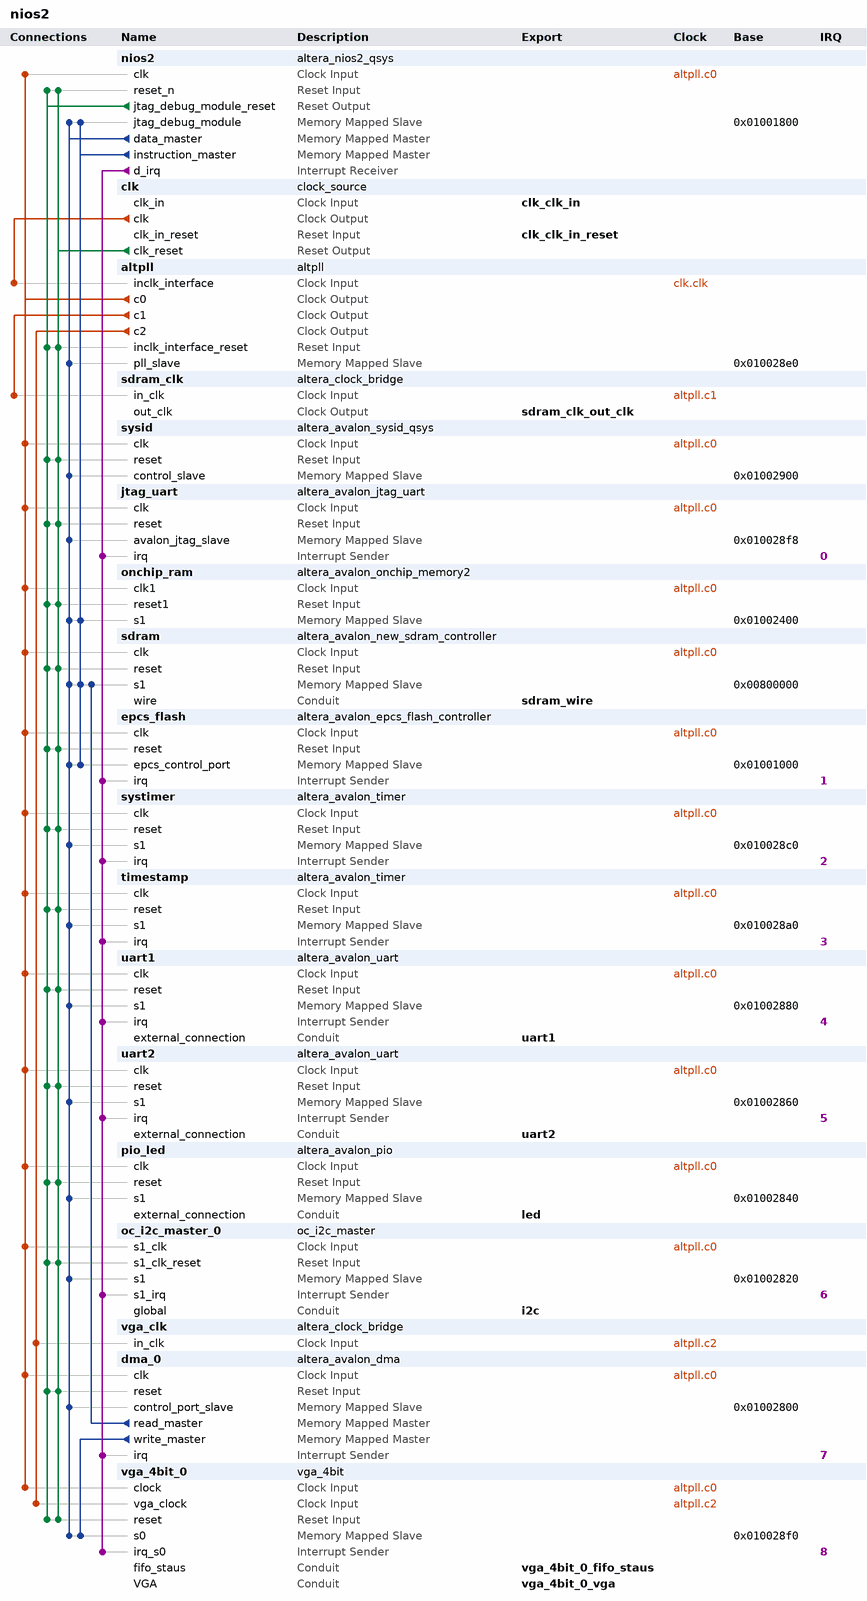
[diagram p0: system contents]
# Platform Designer (Qsys) system nios2, Cyclone II EP2C8T144C8
# Parameters at their usual value, and those the tool derives, are not listed.
package require -exact qsys 13.0.1
create_system nios2
set_project_property DEVICE_FAMILY {Cyclone II}
set_project_property DEVICE EP2C8T144C8

add_instance nios2 altera_nios2_qsys 13.0
set_instance_parameter_value nios2 muldiv_divider true
set_instance_parameter_value nios2 manuallyAssignCpuID false
set_instance_parameter_value nios2 resetSlave sdram.s1
set_instance_parameter_value nios2 mmu_TLBMissExcSlave None
set_instance_parameter_value nios2 exceptionSlave sdram.s1
set_instance_parameter_value nios2 breakSlave nios2.jtag_debug_module
set_instance_parameter_value nios2 impl Tiny
set_instance_parameter_value nios2 icache_size 4096

add_instance clk clock_source 13.0
set_instance_parameter_value clk clockFrequency 32000000

add_instance altpll altpll 13.0
set_instance_parameter_value altpll INCLK0_INPUT_FREQUENCY 31250
set_instance_parameter_value altpll GATE_LOCK_SIGNAL NO
set_instance_parameter_value altpll VALID_LOCK_MULTIPLIER 1
set_instance_parameter_value altpll INVALID_LOCK_MULTIPLIER 5
set_instance_parameter_value altpll CLK0_MULTIPLY_BY 3
set_instance_parameter_value altpll CLK1_MULTIPLY_BY 3
set_instance_parameter_value altpll CLK2_MULTIPLY_BY 5
set_instance_parameter_value altpll CLK0_DIVIDE_BY 1
set_instance_parameter_value altpll CLK1_DIVIDE_BY 1
set_instance_parameter_value altpll CLK2_DIVIDE_BY 4
set_instance_parameter_value altpll CLK1_PHASE_SHIFT -2604
set_instance_parameter_value altpll CLK2_PHASE_SHIFT 0
set_instance_parameter_value altpll CLK1_DUTY_CYCLE 50
set_instance_parameter_value altpll CLK2_DUTY_CYCLE 50
set_instance_parameter_value altpll PORT_clk1 PORT_USED
set_instance_parameter_value altpll PORT_clk2 PORT_USED
set_instance_parameter_value altpll PORT_clk3 PORT_UNUSED
set_instance_parameter_value altpll PORT_ARESET PORT_UNUSED
set_instance_parameter_value altpll PORT_LOCKED PORT_UNUSED

add_instance sdram_clk altera_clock_bridge 13.0
set_instance_parameter_value sdram_clk DERIVED_CLOCK_RATE 96000000
set_instance_parameter_value sdram_clk EXPLICIT_CLOCK_RATE 0

add_instance sysid altera_avalon_sysid_qsys 13.0
set_instance_parameter_value sysid id 0

add_instance jtag_uart altera_avalon_jtag_uart 13.0.1
set_instance_parameter_value jtag_uart simInteractiveOptions NO_INTERACTIVE_WINDOWS

add_instance onchip_ram altera_avalon_onchip_memory2 13.0.1
set_instance_parameter_value onchip_ram dataWidth 16
set_instance_parameter_value onchip_ram dualPort false
set_instance_parameter_value onchip_ram initMemContent false
set_instance_parameter_value onchip_ram initializationFileName onchip_mem.hex
set_instance_parameter_value onchip_ram memorySize 1024

add_instance sdram altera_avalon_new_sdram_controller 13.0.1
set_instance_parameter_value sdram TAC 6.0
set_instance_parameter_value sdram TRCD 20.0
set_instance_parameter_value sdram TRP 20.0
set_instance_parameter_value sdram casLatency 2
set_instance_parameter_value sdram columnWidth 8
set_instance_parameter_value sdram dataWidth 16
set_instance_parameter_value sdram generateSimulationModel false
set_instance_parameter_value sdram model single_Micron_MT48LC4M32B2_7_chip
set_instance_parameter_value sdram numberOfBanks 4
set_instance_parameter_value sdram numberOfChipSelects 1
set_instance_parameter_value sdram powerUpDelay 100.0
set_instance_parameter_value sdram refreshPeriod 15.625
set_instance_parameter_value sdram rowWidth 12

add_instance epcs_flash altera_avalon_epcs_flash_controller 13.0.1

add_instance systimer altera_avalon_timer 13.0.1
set_instance_parameter_value systimer period 1
set_instance_parameter_value systimer periodUnits MSEC

add_instance timestamp altera_avalon_timer 13.0.1
set_instance_parameter_value timestamp period 1
set_instance_parameter_value timestamp periodUnits USEC

add_instance uart1 altera_avalon_uart 13.0.1
set_instance_parameter_value uart1 baud 115200
set_instance_parameter_value uart1 dataBits 8
set_instance_parameter_value uart1 fixedBaud true
set_instance_parameter_value uart1 parity NONE
set_instance_parameter_value uart1 stopBits 1

add_instance uart2 altera_avalon_uart 13.0.1
set_instance_parameter_value uart2 baud 115200
set_instance_parameter_value uart2 dataBits 8
set_instance_parameter_value uart2 fixedBaud true
set_instance_parameter_value uart2 parity NONE
set_instance_parameter_value uart2 stopBits 1

add_instance pio_led altera_avalon_pio 13.0.1
set_instance_parameter_value pio_led bitModifyingOutReg true
set_instance_parameter_value pio_led direction Output
set_instance_parameter_value pio_led width 4

add_instance oc_i2c_master_0 oc_i2c_master 2.1.1

add_instance vga_clk altera_clock_bridge 13.0
set_instance_parameter_value vga_clk DERIVED_CLOCK_RATE 40000000
set_instance_parameter_value vga_clk EXPLICIT_CLOCK_RATE 40000000

add_instance dma_0 altera_avalon_dma 13.0.1
set_instance_parameter_value dma_0 allowByteTransactions true
set_instance_parameter_value dma_0 allowDoubleWordTransactions true
set_instance_parameter_value dma_0 allowHalfWordTransactions true
set_instance_parameter_value dma_0 allowQuadWordTransactions true
set_instance_parameter_value dma_0 burstEnable false
set_instance_parameter_value dma_0 fifoDepth 1024
set_instance_parameter_value dma_0 maxBurstSize 128
set_instance_parameter_value dma_0 minimumDmaTransactionRegisterWidth 32

add_instance vga_4bit_0 vga_4bit 1.0

# connections
add_connection altpll.c0 dma_0.clk clock
add_connection altpll.c0 epcs_flash.clk clock
add_connection altpll.c0 jtag_uart.clk clock
add_connection altpll.c0 nios2.clk clock
add_connection altpll.c0 oc_i2c_master_0.s1_clk clock
add_connection altpll.c0 onchip_ram.clk1 clock
add_connection altpll.c0 pio_led.clk clock
add_connection altpll.c0 sdram.clk clock
add_connection altpll.c0 sysid.clk clock
add_connection altpll.c0 systimer.clk clock
add_connection altpll.c0 timestamp.clk clock
add_connection altpll.c0 uart1.clk clock
add_connection altpll.c0 uart2.clk clock
add_connection altpll.c0 vga_4bit_0.clock clock
add_connection altpll.c1 sdram_clk.in_clk clock
add_connection altpll.c2 vga_4bit_0.vga_clock clock
add_connection altpll.c2 vga_clk.in_clk clock
add_connection clk.clk altpll.inclk_interface clock
add_connection clk.clk_reset altpll.inclk_interface_reset reset
add_connection clk.clk_reset dma_0.reset reset
add_connection clk.clk_reset epcs_flash.reset reset
add_connection clk.clk_reset jtag_uart.reset reset
add_connection clk.clk_reset nios2.reset_n reset
add_connection clk.clk_reset oc_i2c_master_0.s1_clk_reset reset
add_connection clk.clk_reset onchip_ram.reset1 reset
add_connection clk.clk_reset pio_led.reset reset
add_connection clk.clk_reset sdram.reset reset
add_connection clk.clk_reset sysid.reset reset
add_connection clk.clk_reset systimer.reset reset
add_connection clk.clk_reset timestamp.reset reset
add_connection clk.clk_reset uart1.reset reset
add_connection clk.clk_reset uart2.reset reset
add_connection clk.clk_reset vga_4bit_0.reset reset
add_connection nios2.jtag_debug_module_reset altpll.inclk_interface_reset reset
add_connection nios2.jtag_debug_module_reset dma_0.reset reset
add_connection nios2.jtag_debug_module_reset epcs_flash.reset reset
add_connection nios2.jtag_debug_module_reset jtag_uart.reset reset
add_connection nios2.jtag_debug_module_reset nios2.reset_n reset
add_connection nios2.jtag_debug_module_reset oc_i2c_master_0.s1_clk_reset reset
add_connection nios2.jtag_debug_module_reset onchip_ram.reset1 reset
add_connection nios2.jtag_debug_module_reset pio_led.reset reset
add_connection nios2.jtag_debug_module_reset sdram.reset reset
add_connection nios2.jtag_debug_module_reset sysid.reset reset
add_connection nios2.jtag_debug_module_reset systimer.reset reset
add_connection nios2.jtag_debug_module_reset timestamp.reset reset
add_connection nios2.jtag_debug_module_reset uart1.reset reset
add_connection nios2.jtag_debug_module_reset uart2.reset reset
add_connection nios2.jtag_debug_module_reset vga_4bit_0.reset reset
add_connection dma_0.read_master sdram.s1 avalon
set_connection_parameter_value dma_0.read_master/sdram.s1 baseAddress 0x00800000
add_connection dma_0.write_master vga_4bit_0.s0 avalon
set_connection_parameter_value dma_0.write_master/vga_4bit_0.s0 baseAddress 0x010028f0
add_connection nios2.data_master altpll.pll_slave avalon
set_connection_parameter_value nios2.data_master/altpll.pll_slave baseAddress 0x010028e0
add_connection nios2.data_master dma_0.control_port_slave avalon
set_connection_parameter_value nios2.data_master/dma_0.control_port_slave baseAddress 0x01002800
add_connection nios2.data_master epcs_flash.epcs_control_port avalon
set_connection_parameter_value nios2.data_master/epcs_flash.epcs_control_port baseAddress 0x01001000
add_connection nios2.data_master jtag_uart.avalon_jtag_slave avalon
set_connection_parameter_value nios2.data_master/jtag_uart.avalon_jtag_slave baseAddress 0x010028f8
add_connection nios2.data_master nios2.jtag_debug_module avalon
set_connection_parameter_value nios2.data_master/nios2.jtag_debug_module baseAddress 0x01001800
add_connection nios2.data_master oc_i2c_master_0.s1 avalon
set_connection_parameter_value nios2.data_master/oc_i2c_master_0.s1 baseAddress 0x01002820
add_connection nios2.data_master onchip_ram.s1 avalon
set_connection_parameter_value nios2.data_master/onchip_ram.s1 baseAddress 0x01002400
add_connection nios2.data_master pio_led.s1 avalon
set_connection_parameter_value nios2.data_master/pio_led.s1 baseAddress 0x01002840
add_connection nios2.data_master sdram.s1 avalon
set_connection_parameter_value nios2.data_master/sdram.s1 baseAddress 0x00800000
add_connection nios2.data_master sysid.control_slave avalon
set_connection_parameter_value nios2.data_master/sysid.control_slave baseAddress 0x01002900
add_connection nios2.data_master systimer.s1 avalon
set_connection_parameter_value nios2.data_master/systimer.s1 baseAddress 0x010028c0
add_connection nios2.data_master timestamp.s1 avalon
set_connection_parameter_value nios2.data_master/timestamp.s1 baseAddress 0x010028a0
add_connection nios2.data_master uart1.s1 avalon
set_connection_parameter_value nios2.data_master/uart1.s1 baseAddress 0x01002880
add_connection nios2.data_master uart2.s1 avalon
set_connection_parameter_value nios2.data_master/uart2.s1 baseAddress 0x01002860
add_connection nios2.data_master vga_4bit_0.s0 avalon
set_connection_parameter_value nios2.data_master/vga_4bit_0.s0 baseAddress 0x010028f0
add_connection nios2.instruction_master epcs_flash.epcs_control_port avalon
set_connection_parameter_value nios2.instruction_master/epcs_flash.epcs_control_port baseAddress 0x01001000
add_connection nios2.instruction_master nios2.jtag_debug_module avalon
set_connection_parameter_value nios2.instruction_master/nios2.jtag_debug_module baseAddress 0x01001800
add_connection nios2.instruction_master onchip_ram.s1 avalon
set_connection_parameter_value nios2.instruction_master/onchip_ram.s1 baseAddress 0x01002400
add_connection nios2.instruction_master sdram.s1 avalon
set_connection_parameter_value nios2.instruction_master/sdram.s1 baseAddress 0x00800000
add_connection nios2.d_irq dma_0.irq interrupt
set_connection_parameter_value nios2.d_irq/dma_0.irq irqNumber 7
add_connection nios2.d_irq epcs_flash.irq interrupt
set_connection_parameter_value nios2.d_irq/epcs_flash.irq irqNumber 1
add_connection nios2.d_irq jtag_uart.irq interrupt
set_connection_parameter_value nios2.d_irq/jtag_uart.irq irqNumber 0
add_connection nios2.d_irq oc_i2c_master_0.s1_irq interrupt
set_connection_parameter_value nios2.d_irq/oc_i2c_master_0.s1_irq irqNumber 6
add_connection nios2.d_irq systimer.irq interrupt
set_connection_parameter_value nios2.d_irq/systimer.irq irqNumber 2
add_connection nios2.d_irq timestamp.irq interrupt
set_connection_parameter_value nios2.d_irq/timestamp.irq irqNumber 3
add_connection nios2.d_irq uart1.irq interrupt
set_connection_parameter_value nios2.d_irq/uart1.irq irqNumber 4
add_connection nios2.d_irq uart2.irq interrupt
set_connection_parameter_value nios2.d_irq/uart2.irq irqNumber 5
add_connection nios2.d_irq vga_4bit_0.irq_s0 interrupt
set_connection_parameter_value nios2.d_irq/vga_4bit_0.irq_s0 irqNumber 8

# exported interfaces
add_interface clk_clk_in clock sink
set_interface_property clk_clk_in EXPORT_OF clk.clk_in
add_interface clk_clk_in_reset reset sink
set_interface_property clk_clk_in_reset EXPORT_OF clk.clk_in_reset
add_interface sdram_wire conduit end
set_interface_property sdram_wire EXPORT_OF sdram.wire
add_interface sdram_clk_out_clk clock source
set_interface_property sdram_clk_out_clk EXPORT_OF sdram_clk.out_clk
add_interface uart1 conduit end
set_interface_property uart1 EXPORT_OF uart1.external_connection
add_interface uart2 conduit end
set_interface_property uart2 EXPORT_OF uart2.external_connection
add_interface led conduit end
set_interface_property led EXPORT_OF pio_led.external_connection
add_interface i2c conduit end
set_interface_property i2c EXPORT_OF oc_i2c_master_0.global
add_interface vga_4bit_0_vga conduit end
set_interface_property vga_4bit_0_vga EXPORT_OF vga_4bit_0.VGA
add_interface vga_4bit_0_fifo_staus conduit end
set_interface_property vga_4bit_0_fifo_staus EXPORT_OF vga_4bit_0.fifo_staus

set_interconnect_requirement {$system} qsys_mm.clockCrossingAdapter HANDSHAKE
set_interconnect_requirement {$system} qsys_mm.maxAdditionalLatency 0

save_system nios2.qsys
